# EAGLE schematic board_sch (EAGLE 9.5.1)
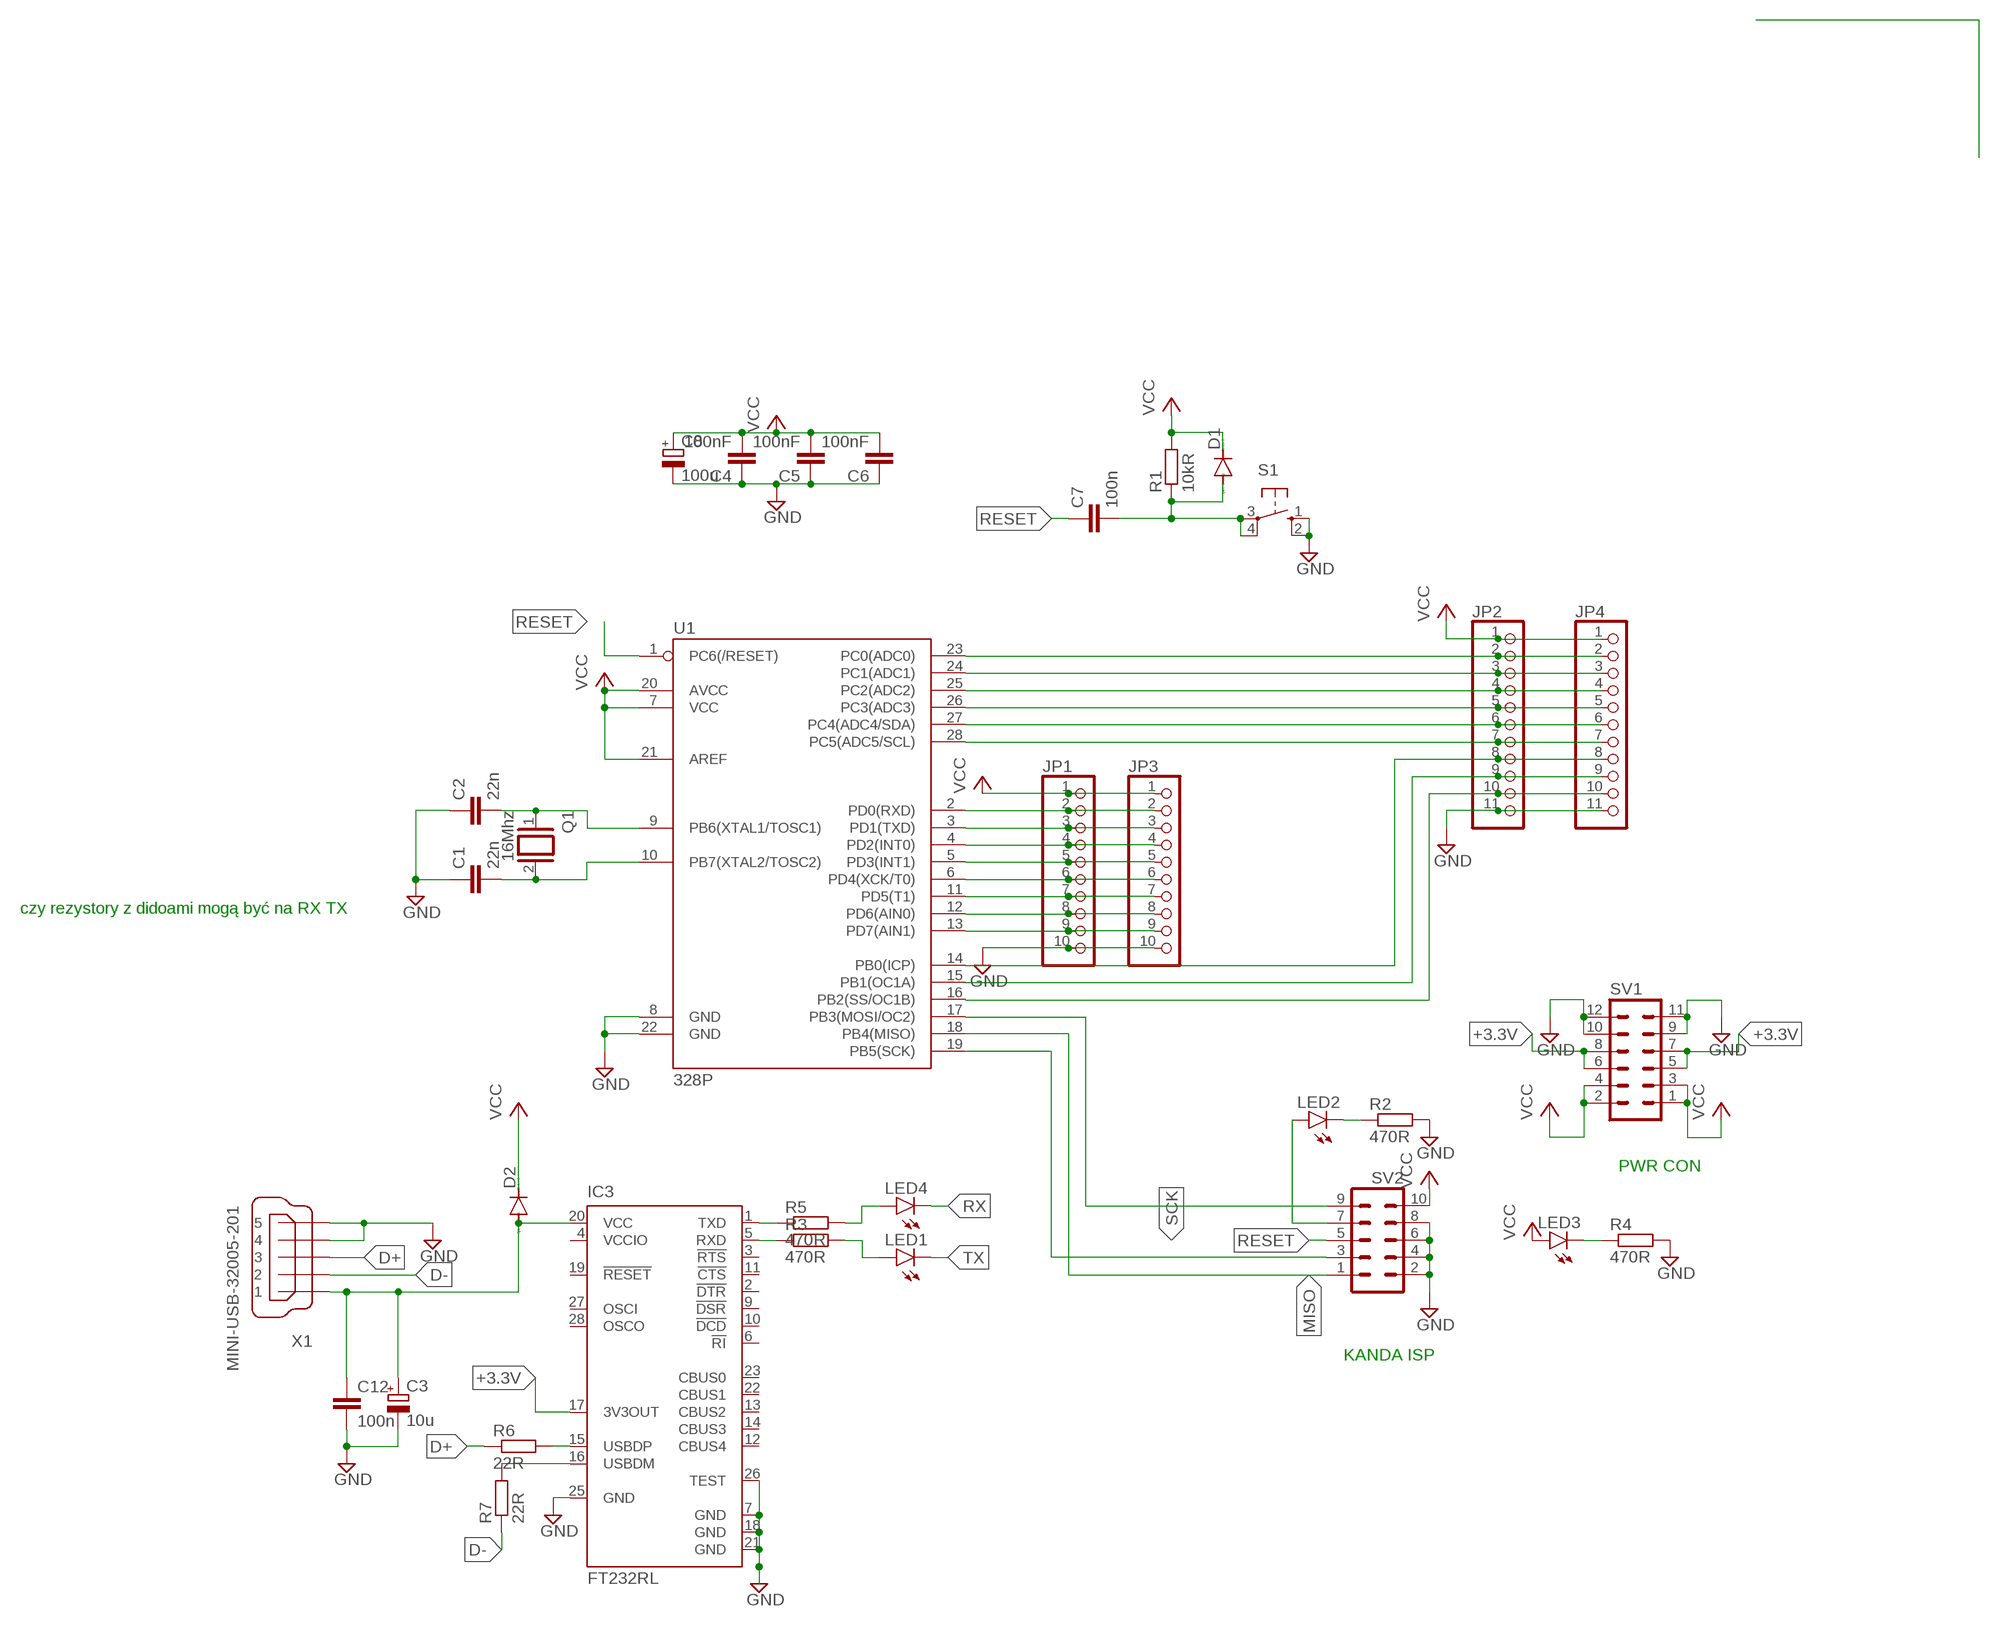
[diagram p0: schematic, sheet 1]

## Parts
C1  22n  C-EUC0805  [C0805]
C2  22n  C-EUC0805  [C0805]
C3  10u  CPOL-EUE2,5-6E  [E2,5-6E]
C4  100nF  C-EU050-025X075  [C050-025X075]
C5  100nF  C-EU050-025X075  [C050-025X075]
C6  100nF  C-EU050-025X075  [C050-025X075]
C7  100n  C-EUC0805  [C0805]
C8  100u  CPOL-EUE2,5-6E  [E2,5-6E]
C12  100n  C-EUC0805  [C0805]
D1  DIODE-DO214AC  [DO214AC]
D2  DIODE-DO214AC  [DO214AC]
IC3  FT232RL  [SSOP28]
JP1  PINHD-1X10  [1X10]
JP2  PINHD-1X11  [1X11]
JP3  PINHD-1X10  [1X10]
JP4  PINHD-1X11  [1X11]
LED1  LEDCHIPLED_0805  [CHIPLED_0805]
LED2  LEDCHIPLED_0805  [CHIPLED_0805]
LED3  LEDCHIPLED_0805  [CHIPLED_0805]
LED4  LEDCHIPLED_0805  [CHIPLED_0805]
Q1  16Mhz  XTAL/S  [QS]
R1  10kR  R-EU_R0805  [R0805]
R2  470R  R-EU_R0805  [R0805]
R3  470R  R-EU_R0805  [R0805]
R4  470R  R-EU_R0805  [R0805]
R5  470R  R-EU_R0805  [R0805]
R6  22R  R-EU_R0805  [R0805]
R7  22R  R-EU_R0805  [R0805]
S1  10-XX  [B3F-10XX]
SV1  MA06-2  [MA06-2]
SV2  ML10L  [ML10L]
U1  328P  ATMEGA328P_PDIP  [DIP28]
X1  MINI-USB-32005-201  [32005-201]

## Nets
+3.3V: IC3.17(3V3OUT) SV1.5 SV1.6 SV1.7 SV1.8
D+: IC3.15(USBDP) R6.1 R6.2 X1.3
D-: IC3.16(USBDM) R7.1 R7.2 X1.2
GND: C1.1 C2.1 C3.- C4.1 C5.1 C6.1 C8.- C12.2 IC3.7(GND) IC3.18(GND) IC3.21(GND) IC3.25(GND) IC3.26(TEST) JP1.10 JP2.11 JP3.10 JP4.11 R2.2 R4.2 S1.1(S) S1.2(S1) SV1.9 SV1.10 SV1.11 SV1.12 SV2.2 SV2.4 SV2.6 SV2.8 U1.8(GND) U1.22(GND) X1.4 X1.5
MISO: SV2.1 U1.18(PB4(MISO))
N$1: C2.2 Q1.1 U1.9(PB6(XTAL1/TOSC1))
N$2: C1.2 Q1.2 U1.10(PB7(XTAL2/TOSC2))
N$3: LED2.A SV2.7
N$4: SV2.9 U1.17(PB3(MOSI/OC2))
N$5: C3.+ C12.1 D2.A IC3.20(VCC) X1.1
N$7: IC3.1(TXD) R5.1
N$8: LED3.C R4.1
N$10: JP1.4 JP3.4 U1.4(PD2(INT0))
N$11: JP1.5 JP3.5 U1.5(PD3(INT1))
N$12: JP1.6 JP3.6 U1.6(PD4(XCK/T0))
N$13: JP1.7 JP3.7 U1.11(PD5(T1))
N$14: JP1.8 JP3.8 U1.12(PD6(AIN0))
N$15: JP1.9 JP3.9 U1.13(PD7(AIN1))
N$16: IC3.5(RXD) R3.1
N$17: LED2.C R2.1
N$18: JP2.2 JP4.2 U1.23(PC0(ADC0))
N$19: JP2.3 JP4.3 U1.24(PC1(ADC1))
N$20: JP2.4 JP4.4 U1.25(PC2(ADC2))
N$21: JP2.5 JP4.5 U1.26(PC3(ADC3))
N$22: JP2.6 JP4.6 U1.27(PC4(ADC4/SDA))
N$23: JP2.7 JP4.7 U1.28(PC5(ADC5/SCL))
N$24: JP2.8 JP4.8 U1.14(PB0(ICP))
N$25: JP2.9 JP4.9 U1.15(PB1(OC1A))
N$26: JP2.10 JP4.10 U1.16(PB2(SS/OC1B))
N$27: LED4.A R5.2
N$28: LED1.A R3.2
RESET: C7.1 C7.2 D1.A R1.1 S1.3(P) S1.4(P1) SV2.5 U1.1(PC6(/RESET))
RX: JP1.2 JP3.2 LED4.C U1.2(PD0(RXD))
SCK: SV2.3 U1.19(PB5(SCK))
TX: JP1.3 JP3.3 LED1.C U1.3(PD1(TXD))
VCC: C4.2 C5.2 C6.2 C8.+ D1.C D2.C JP1.1 JP2.1 JP3.1 JP4.1 LED3.A R1.2 SV1.1 SV1.2 SV1.3 SV1.4 SV2.10 U1.7(VCC) U1.20(AVCC) U1.21(AREF)
Unconnected: IC3.2(!DTR) IC3.3(!RTS) IC3.6(!RI) IC3.9(!DSR) IC3.10(!DCD) IC3.11(!CTS) IC3.12(CBUS4) IC3.13(CBUS2) IC3.14(CBUS3) IC3.19(!RESET) IC3.22(CBUS1) IC3.23(CBUS0) IC3.27(OSCI) IC3.28(OSCO)

## Notes on the sheet
- czy rezystory z didoami mogą być na RX TX
- PWR CON
- KANDA ISP

## Power pins joined to a net without a drawn wire
VCCIO: IC3.4(VCCIO)

## Library data of the parts
C1 C2 C4-C7 C12 = rcl:C-EU: CAPACITOR, European symbol; SPICEPREFIX: C
C3 C8 = rcl:CPOL-EU: POLARIZED CAPACITOR, European symbol; SPICEPREFIX: C
D1 D2 = diode:DIODE-: DIODE
IC3 = ftdichip:FT232R: Source: http://www.ftdichip.com/Documents/DataSheets/DS_FT232R_v104.pdf; MPN: FT232RL; OC_FARNELL: 1146032; OC_NEWARK: 91K9918
JP1 JP3 = pinhead:PINHD-1X10: PIN HEADER
JP2 JP4 = pinhead:PINHD-1X11: PIN HEADER
LED1-LED4 = led:LED: LED OSRAM: - CHIPLED LG R971, LG N971, LY N971, LG Q971, LY Q971, LO R971, LY R971 LH N974, LH R974 LS Q976, LO Q976, LY Q976 LO Q996 - Hyper CHIPLED LW Q18S LB Q993, LB Q99A, LB R99A - SideLED LS A670, LO A670, LY A670, LG A670, LP A670 LB A673, LV A673, LT A673, LW A673 LH A674 LY A675 LS A676, LA A676, LO A676, LY A676, LW A676 LS A679, LY A679, LG A679 - Hyper Micro SIDELED® LS Y876, LA Y876, LO Y876, LY Y876 LT Y87S - SmartLED LW L88C, LW L88S LB L89C, LB L89S, LG L890 LS L89K, LO L89K, LY L89K LS L896, LA L896, LO L896, LY L896 - TOPLED LS T670, LO T670, LY T670, LG T670, LP T670 LSG T670, LSP T670, LSY T670, LOP T670, LYG T670 LG T671, LOG T671, LSG T671 LB T673, LV T673, LT T673, LW T673 LH T674 LS T676, LA T676, LO T676, LY T676, LB T676, LH T676, LSB T676, LW T676 LB T67C, LV T67C, LT T67C, LS T67K, LO T67K, LY T67K, LW E67C LS E67B, LA E67B, LO E67B, LY E67B, LB E67C, LV E67C, LT E67C LW T67C LS T679, LY T679, LG T679 LS T770, LO T770, LY T770, LG T770, LP T770 LB T773, LV T773, LT T773, LW T773 LH T774 LS E675, LA E675, LY E675, LS T675 LS T776, LA T776, LO T776, LY T776, LB T776 LHGB T686 LT T68C, LB T68C - Hyper Mini TOPLED® LB M676 - Mini TOPLED Santana® LG M470 LS M47K, LO M47K, LY M47K Source: http://www.osram.convergy.de LUXEON: - LUMILED® LXK2-PW12-R00, LXK2-PW12-S00, LXK2-PW14-U00, LXK2-PW14-V00 LXK2-PM12-R00, LXK2-PM12-S00, LXK2-PM14-U00 LXK2-PE12-Q00, LXK2-PE12-R00, LXK2-PE12-S00, LXK2-PE14-T00, LXK2-PE14-U00 LXK2-PB12-K00, LXK2-PB12-L00, LXK2-PB12-M00, LXK2-PB14-N00, LXK2-PB14-P00, LXK2-PB14-Q00 LXK2-PR12-L00, LXK2-PR12-M00, LXK2-PR14-Q00, LXK2-PR14-R00 LXK2-PD12-Q00, LXK2-PD12-R00, LXK2-PD12-S00 LXK2-PH12-R00, LXK2-PH12-S00 LXK2-PL12-P00, LXK2-PL12-Q00, LXK2-PL12-R00 Source: www.luxeon.com KINGBRIGHT: KA-3528ASYC Source: www.kingbright.com
Q1 = special:XTAL/S: CRYSTAL
R1-R7 = rcl:R-EU_: RESISTOR, European symbol; SPICEPREFIX: R
S1 = switch-omron:10-XX: OMRON SWITCH; MPN: B3F-1000; OC_FARNELL: 176432; OC_NEWARK: 36M3542
SV1 = con-lstb:MA06-2: PIN HEADER; OC_FARNELL: unknown; OC_NEWARK: unknown
SV2 = con-ml:ML10L: HARTING; OC_FARNELL: unknown; OC_NEWARK: unknown
U1 = SparkFun-IC-Microcontroller:ATMEGA328P_PDIP: Atmel 328P Through hole ATMEGA328P uC used in the Arduino 32kb flash, 1k EEPROM, 2k SRAM Datasheet <http://www.sparkfun.com/datasheets/Components/SMD/ATMega328.pdf> SparkFun Products Storefront component: AVR 28 Pin 20MHz 32K 6A/D - ATMega328P <https://www.sparkfun.com/products/9061> (COM-09061) SparkFun Simon Says - Through-Hole Soldering Kit <https://www.sparkfun.com/products/10547> (KIT-10547) SparkFun Learn to Solder - Simon Says <https://www.sparkfun.com/products/13708> (KIT-13708) SparkFun BigTime Watch Kit <https://www.sparkfun.com/products/11734> (KIT-11734) SparkFun ClockIt <https://www.sparkfun.com/products/10930> (KIT-10930) SparkFun Serial Enabled LCD Kit <https://www.sparkfun.com/products/10097> (LCD-10097) SparkFun Simon Tilts - Through Hole Soldering Kit <https://www.sparkfun.com/products/12634> (KIT-12634) SparkFun Frequency Counter Kit <https://www.sparkfun.com/products/10140> (KIT-10140) FabFM Radio Kit <https://www.sparkfun.com/products/11043> (KIT-11043) SparkFun Binary Blaster Kit <https://www.sparkfun.com/products/12037> (KIT-12037) SparkFun Metro-Gnome <https://www.sparkfun.com/products/9236> (KIT-09236) ATmega328 with Arduino Optiboot (Uno) <https://www.sparkfun.com/products/10524> (DEV-10524); PROD_ID: IC-09136
X1 = con-cypressindustries:MINI-USB-: MINI USB-B Conector Source: www.cypressindustries.com; OC_FARNELL: unknown; OC_NEWARK: unknown